# Altium schematic sheet Top-Level-Sheet.SchDoc
size A3; SheetNumber: 1; SheetTotal: 22
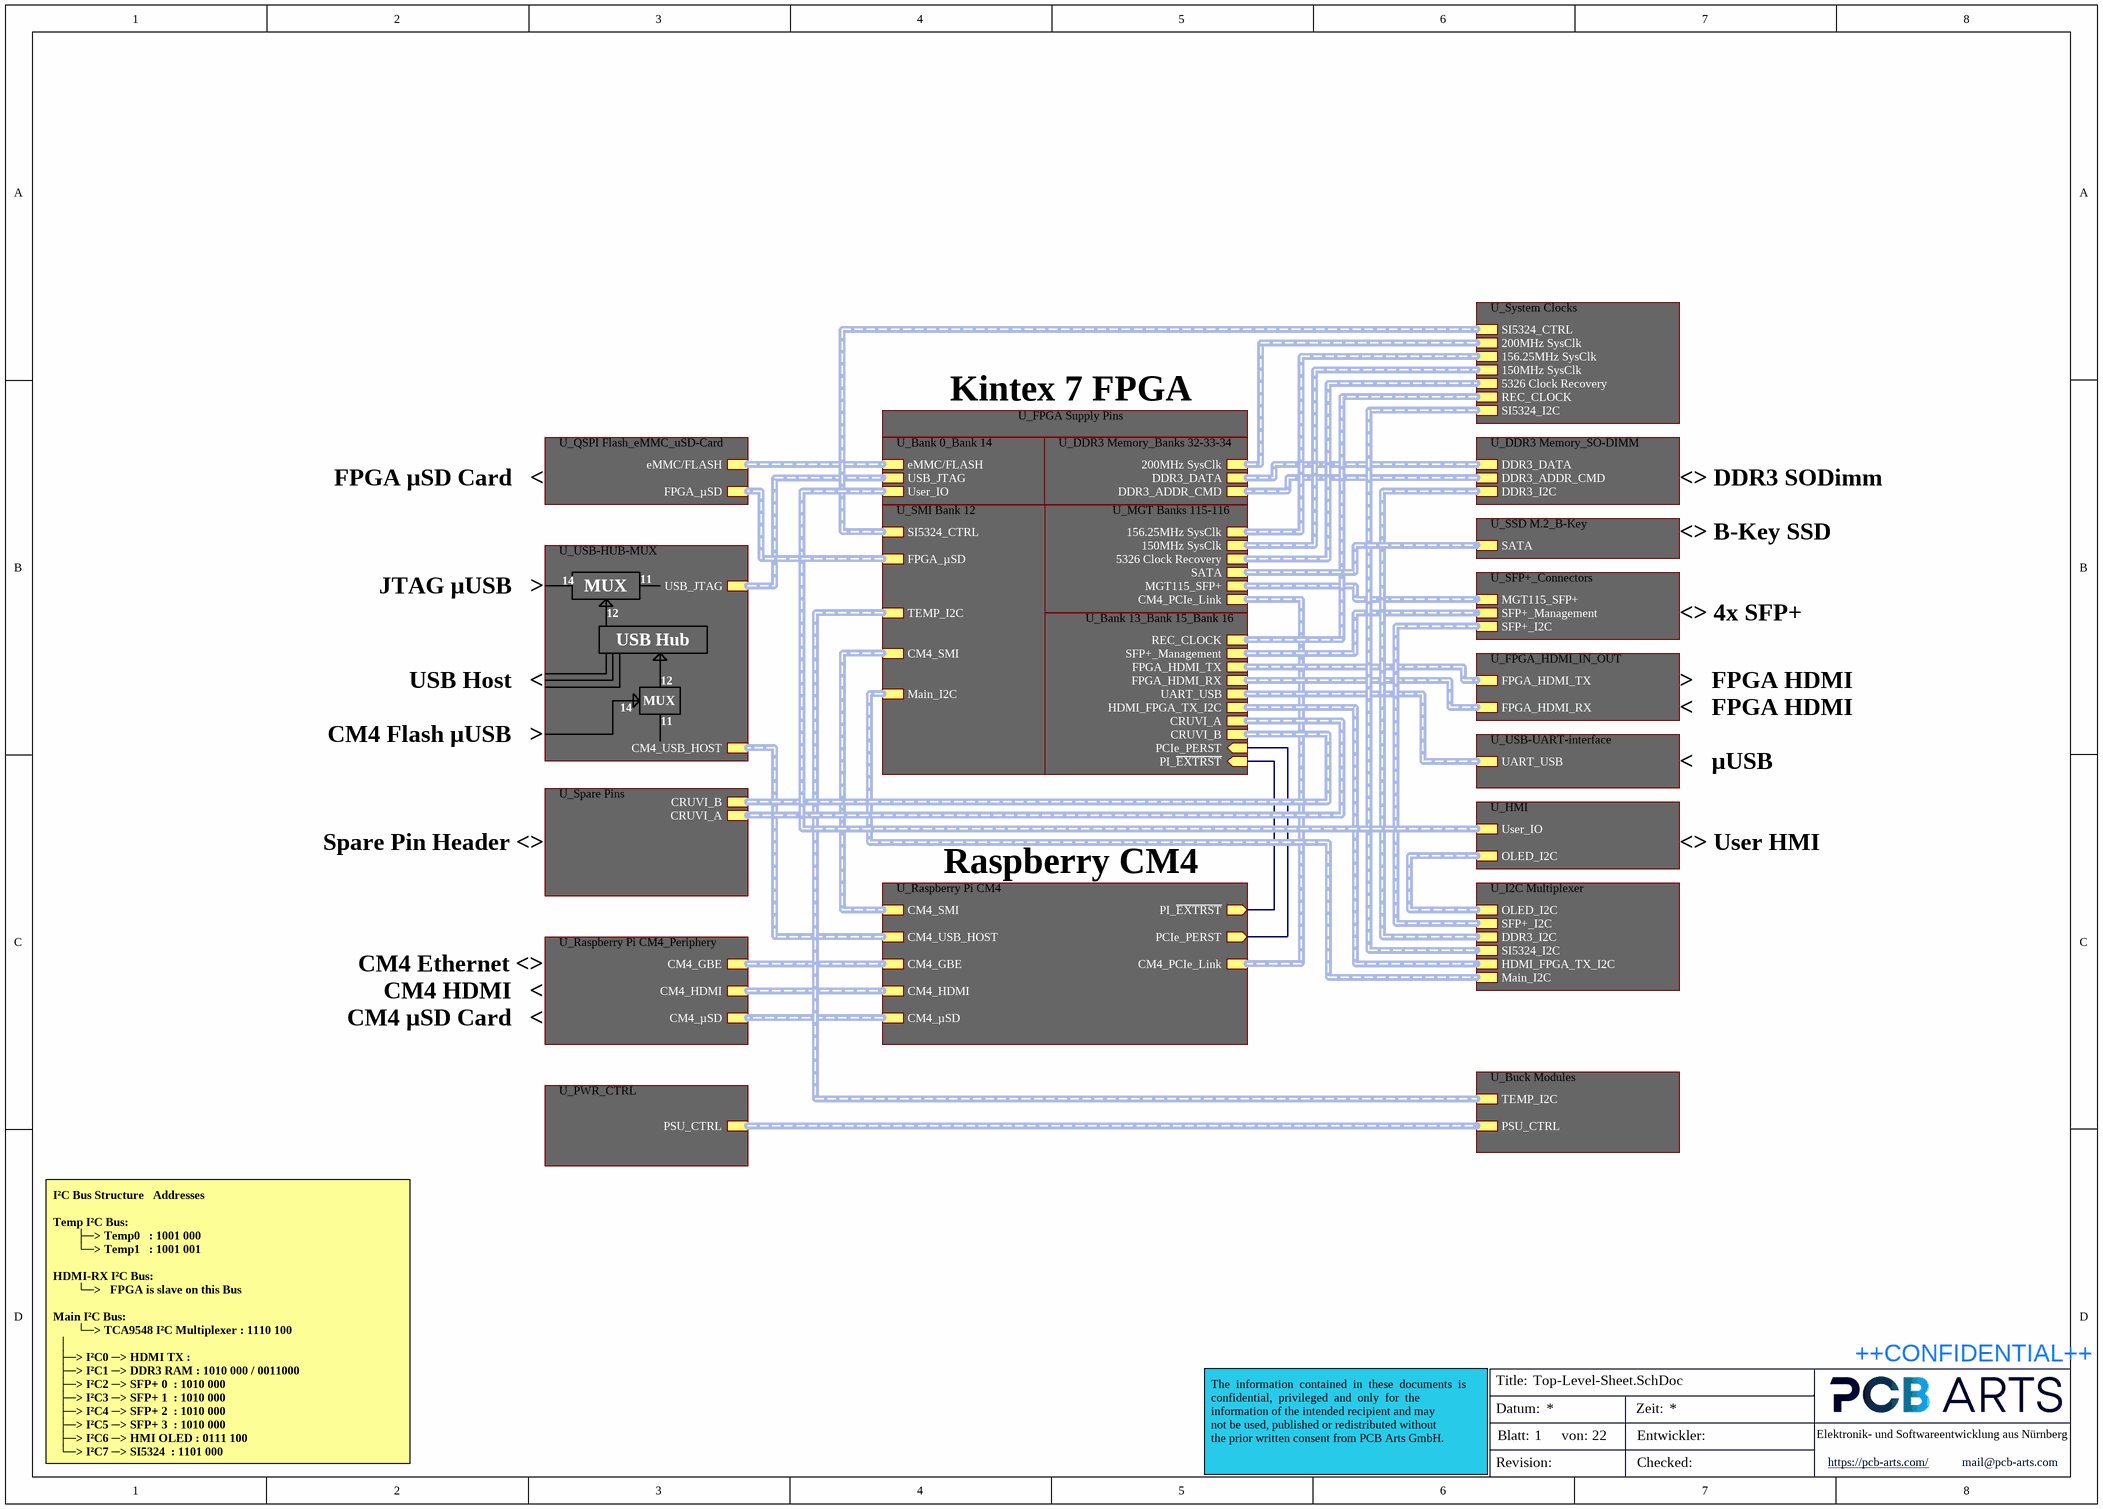
[diagram p0: Top-Level-Sheet.SchDoc]

## Sub-sheets
U_Bank 0_Bank 14 = Bank 0_Bank 14.SchDoc: eMMC/FLASH (harness eMMC/FLASH), USB_JTAG (harness USB_JTAG), User_IO (harness User_IO)
U_Bank 13_Bank 15_Bank 16 = Bank 13_Bank 15_Bank 16.SchDoc: UART_USB (harness UART_USB), FPGA_HDMI_TX (harness FPGA_HDMI_TX), FPGA_HDMI_RX (harness FPGA_HDMI_RX), HDMI_FPGA_TX_I2C (harness HDMI_FPGA_TX_I2C), SFP+_Management (harness SFP+_Management), REC_CLOCK (harness REC_CLOCK), PCIe_PERST (in), PI_~{EXTRST} (in), CRUVI_A (harness CRUVI_A), CRUVI_B (harness CRUVI_B)
U_Buck Modules = Buck Modules.SchDoc: PSU_CTRL (harness PSU_CTRL), TEMP_I2C (harness TEMP_I2C)
U_DDR3 Memory_Banks 32-33-34 = DDR3 Memory_Banks 32-33-34.SchDoc: DDR3_DATA (harness DDR3_DATA), DDR3_ADDR_CMD (harness DDR3_ADDR_CMD), 200MHz SysClk (harness 200MHz SysClk)
U_DDR3 Memory_SO-DIMM = DDR3 Memory_SO-DIMM.SchDoc: DDR3_DATA (harness DDR3_DATA), DDR3_ADDR_CMD (harness DDR3_ADDR_CMD), DDR3_I2C (harness DDR3_I2C)
U_FPGA Supply Pins = FPGA Supply Pins.SchDoc: no entries
U_FPGA_HDMI_IN_OUT = FPGA_HDMI_IN_OUT.SchDoc: FPGA_HDMI_TX (harness FPGA_HDMI_TX), FPGA_HDMI_RX (harness FPGA_HDMI_RX)
U_HMI = HMI.SchDoc: User_IO (harness User_IO), OLED_I2C (harness OLED_I2C)
U_I2C Multiplexer = I2C Multiplexer.SchDoc: HDMI_FPGA_TX_I2C (harness HDMI_FPGA_TX_I2C), DDR3_I2C (harness DDR3_I2C), SFP+_I2C (harness SFP+_I2C), OLED_I2C (harness OLED_I2C), Main_I2C (harness Main_I2C), SI5324_I2C (harness SI5324_I2C)
U_MGT Banks 115-116 = MGT Banks 115-116.SchDoc: MGT115_SFP+ (harness MGT115_SFP+), CM4_PCIe_Link (harness CM4_PCIe_Link), SATA (harness SATA), 150MHz SysClk (harness 150MHz SysClk), 5326 Clock Recovery (harness 5326 Clock Recovery), 156.25MHz SysClk (harness 156.25MHz SysClk)
U_PWR_CTRL = PWR_CTRL.SchDoc: PSU_CTRL (harness PSU_CTRL)
U_QSPI Flash_eMMC_uSD-Card = QSPI Flash_eMMC_uSD-Card.SchDoc: FPGA_µSD (harness FPGA_µSD), eMMC/FLASH (harness eMMC/FLASH)
U_Raspberry Pi CM4 = Raspberry Pi CM4.SchDoc: CM4_GBE (harness CM4_GBE), CM4_HDMI (harness CM4_HDMI), CM4_PCIe_Link (harness CM4_PCIe_Link), CM4_USB_HOST (harness CM4_USB_HOST), CM4_µSD (harness CM4_µSD), CM4_SMI (harness CM4_SMI), PCIe_PERST (out), PI_~{EXTRST} (out)
U_Raspberry Pi CM4_Periphery = Raspberry Pi CM4_Periphery.SchDoc: CM4_GBE (harness CM4_GBE), CM4_HDMI (harness CM4_HDMI), CM4_µSD (harness CM4_µSD)
U_SFP+_Connectors = SFP+_Connectors.SchDoc: MGT115_SFP+ (harness MGT115_SFP+), SFP+_Management (harness SFP+_Management), SFP+_I2C (harness SFP+_I2C)
U_SMI Bank 12 = SMI Bank 12.SchDoc: CM4_SMI (harness CM4_SMI), FPGA_µSD (harness FPGA_µSD), Main_I2C (harness Main_I2C), SI5324_CTRL (harness SI5324_CTRL), TEMP_I2C (harness TEMP_I2C)
U_Spare Pins = Spare Pins.SchDoc: CRUVI_A (harness CRUVI_A), CRUVI_B (harness CRUVI_B)
U_SSD M.2_B-Key = SSD M.2_B-Key.SchDoc: SATA (harness SATA)
U_System Clocks = System Clocks.SchDoc: 150MHz SysClk (harness 150MHz SysClk), 5326 Clock Recovery (harness 5326 Clock Recovery), 200MHz SysClk (harness 200MHz SysClk), REC_CLOCK (harness REC_CLOCK), SI5324_I2C (harness SI5324_I2C), SI5324_CTRL (harness SI5324_CTRL), 156.25MHz SysClk (harness 156.25MHz SysClk)
U_USB-HUB-MUX = USB-HUB-MUX.SchDoc: CM4_USB_HOST (harness CM4_USB_HOST), USB_JTAG (harness USB_JTAG)
U_USB-UART-interface = USB-UART-interface.SchDoc: UART_USB (harness UART_USB)

## Nets
(unnamed): sheet U_Bank 13_Bank 15_Bank 16/PCIe_PERST, sheet U_Raspberry Pi CM4/PCIe_PERST
(unnamed): sheet U_Bank 13_Bank 15_Bank 16/PI_~{EXTRST}, sheet U_Raspberry Pi CM4/PI_~{EXTRST}

## Buses and harness runs
harness sheet U_Bank 0_Bank 14/eMMC/FLASH = sheet U_QSPI Flash_eMMC_uSD-Card/eMMC/FLASH
harness sheet U_Bank 0_Bank 14/USB_JTAG = sheet U_USB-HUB-MUX/USB_JTAG
harness sheet U_Bank 0_Bank 14/User_IO = sheet U_HMI/User_IO
harness sheet U_Bank 13_Bank 15_Bank 16/CRUVI_A = sheet U_Spare Pins/CRUVI_A
harness sheet U_Bank 13_Bank 15_Bank 16/CRUVI_B = sheet U_Spare Pins/CRUVI_B
harness sheet U_Bank 13_Bank 15_Bank 16/FPGA_HDMI_RX = sheet U_FPGA_HDMI_IN_OUT/FPGA_HDMI_RX
harness sheet U_Bank 13_Bank 15_Bank 16/FPGA_HDMI_TX = sheet U_FPGA_HDMI_IN_OUT/FPGA_HDMI_TX
harness sheet U_Bank 13_Bank 15_Bank 16/HDMI_FPGA_TX_I2C = sheet U_I2C Multiplexer/HDMI_FPGA_TX_I2C
harness sheet U_Bank 13_Bank 15_Bank 16/REC_CLOCK = sheet U_System Clocks/REC_CLOCK
harness sheet U_Bank 13_Bank 15_Bank 16/SFP+_Management = sheet U_SFP+_Connectors/SFP+_Management
harness sheet U_Bank 13_Bank 15_Bank 16/UART_USB = sheet U_USB-UART-interface/UART_USB
harness sheet U_Buck Modules/PSU_CTRL = sheet U_PWR_CTRL/PSU_CTRL
harness sheet U_Buck Modules/TEMP_I2C = sheet U_SMI Bank 12/TEMP_I2C
harness sheet U_DDR3 Memory_Banks 32-33-34/200MHz SysClk = sheet U_System Clocks/200MHz SysClk
harness sheet U_DDR3 Memory_Banks 32-33-34/DDR3_ADDR_CMD = sheet U_DDR3 Memory_SO-DIMM/DDR3_ADDR_CMD
harness sheet U_DDR3 Memory_Banks 32-33-34/DDR3_DATA = sheet U_DDR3 Memory_SO-DIMM/DDR3_DATA
harness sheet U_DDR3 Memory_SO-DIMM/DDR3_I2C = sheet U_I2C Multiplexer/DDR3_I2C
harness sheet U_HMI/OLED_I2C = sheet U_I2C Multiplexer/OLED_I2C
harness sheet U_I2C Multiplexer/Main_I2C = sheet U_SMI Bank 12/Main_I2C
harness sheet U_I2C Multiplexer/SFP+_I2C = sheet U_SFP+_Connectors/SFP+_I2C
harness sheet U_I2C Multiplexer/SI5324_I2C = sheet U_System Clocks/SI5324_I2C
harness sheet U_MGT Banks 115-116/150MHz SysClk = sheet U_System Clocks/150MHz SysClk
harness sheet U_MGT Banks 115-116/156.25MHz SysClk = sheet U_System Clocks/156.25MHz SysClk
harness sheet U_MGT Banks 115-116/5326 Clock Recovery = sheet U_System Clocks/5326 Clock Recovery
harness sheet U_MGT Banks 115-116/CM4_PCIe_Link = sheet U_Raspberry Pi CM4/CM4_PCIe_Link
harness sheet U_MGT Banks 115-116/MGT115_SFP+ = sheet U_SFP+_Connectors/MGT115_SFP+
harness sheet U_MGT Banks 115-116/SATA = sheet U_SSD M.2_B-Key/SATA
harness sheet U_QSPI Flash_eMMC_uSD-Card/FPGA_µSD = sheet U_SMI Bank 12/FPGA_µSD
harness sheet U_Raspberry Pi CM4/CM4_GBE = sheet U_Raspberry Pi CM4_Periphery/CM4_GBE
harness sheet U_Raspberry Pi CM4/CM4_HDMI = sheet U_Raspberry Pi CM4_Periphery/CM4_HDMI
harness sheet U_Raspberry Pi CM4/CM4_SMI = sheet U_SMI Bank 12/CM4_SMI
harness sheet U_Raspberry Pi CM4/CM4_USB_HOST = sheet U_USB-HUB-MUX/CM4_USB_HOST
harness sheet U_Raspberry Pi CM4/CM4_µSD = sheet U_Raspberry Pi CM4_Periphery/CM4_µSD
harness sheet U_SMI Bank 12/SI5324_CTRL = sheet U_System Clocks/SI5324_CTRL

## Notes on the sheet
- Kintex 7 FPGA
- FPGA µSD Card   <
- <> DDR3 SODimm
- JTAG µUSB   >
- 14
- MUX
- 11
- <> B-Key SSD
- 12
- USB Hub
- <> 4x SFP+
- USB Host   <
- >   FPGA HDMI
- <   FPGA HDMI
- CM4 Flash µUSB   >
- <   µUSB
- Spare Pin Header <>
- <> User HMI
- Raspberry CM4
- CM4 HDMI   <
- CM4 Ethernet <>
- CM4 µSD Card   <
- I²C Bus Structure			Addresses
  Temp I²C Bus:
  ├─>	Temp0			: 1001 000
  └─>	Temp1			: 1001 001
  HDMI-RX I²C Bus:
  └─>			FPGA is slave on this Bus
  Main I²C Bus:
  └─>	TCA9548 I²C Multiplexer	: 1110 100
  │
  ├─> I²C0 ─> HDMI TX	:
  ├─> I²C1 ─> DDR3 RAM	: 1010 000 / 0011000
  ├─> I²C2 ─> SFP+ 0		: 1010 000
  ├─> I²C3 ─> SFP+ 1		: 1010 000
  ├─> I²C4 ─> SFP+ 2		: 1010 000
  ├─> I²C5 ─> SFP+ 3		: 1010 000
  ├─> I²C6 ─> HMI OLED	: 0111 100
  └─> I²C7 ─> SI5324		: 1101 000
- Title:
- ++CONFIDENTIAL++
- Datum:
- Blatt:
- von:
- Zeit:
- Entwickler:
- Elektronik- und Softwareentwicklung aus Nürnberg
- The  information  contained  in  these  documents  is  confidential,  privileged  and  only  for  the
  information of the intended recipient and may
  not be used, published or redistributed without
  the prior written consent from PCB Arts GmbH.
- Revision:
- Checked:
- https://pcb-arts.com/
- mail@pcb-arts.com